# EAGLE design tractor_1v2 (EAGLE 9.0.1)
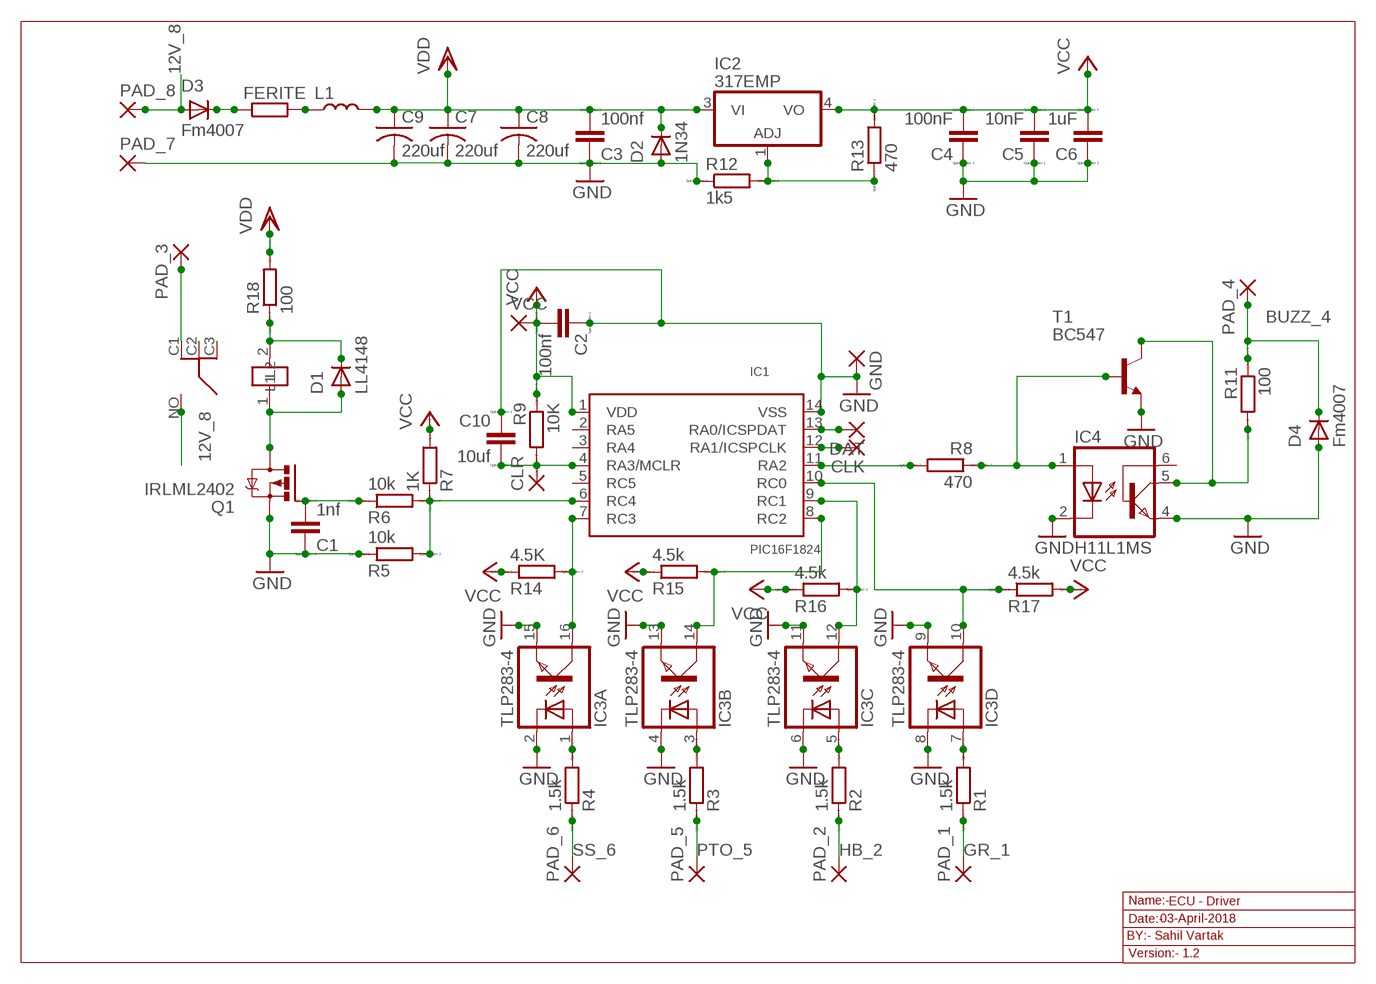
[diagram p0: schematic, sheet 1]

## Parts
C1  1nf  CC0603  [C0603]
C2  100nf  CC0603  [C0603]
C3  100nf  CC0603  [C0603]
C4  100nF  CC0603  [C0603]
C5  10nF  CC0603  [C0603]
C6  1uF  CC0603  [C0603]
C7  220uf  C-US025-025X050  [C025-025X050]
C8  220uf  C-US025-025X050  [C025-025X050]
C9  220uf  C-US025-025X050  [C025-025X050]
C10  10uf  CC0603  [C0603]
CLK  1,6/0,8  [1,6/0,8]
CLR  1,6/0,8  [1,6/0,8]
D1  LL4148  GF1  [SMA-DO214AC]
D2  1N34  GF1  [SMA-DO214AC]
D3  Fm4007  GF1  [SMA-DO214AC]
D4  Fm4007  GF1  [SMA-DO214AC]
DAT  1,6/0,8  [1,6/0,8]
FERITE  R-EU_R0603  [R0603]
GND  1,6/0,8  [1,6/0,8]
IC1  PIC16F1824  [SO-14]
IC2  317EMP  [SOT223]
IC3  TLP283-4  [MINI-FLAT-16]
IC4  H11L1MS  [DIL6-SMD]
K2  RL703  [RL703]
L1  R-US_WSC2515  [WSC2515]
PAD_1  2,54/1,1  [2,54/1,1]
PAD_2  2,54/1,1  [2,54/1,1]
PAD_3  2,54/1,1  [2,54/1,1]
PAD_4  2,54/1,1  [2,54/1,1]
PAD_5  2,54/1,1  [2,54/1,1]
PAD_6  2,54/1,1  [2,54/1,1]
PAD_7  2,54/1,1  [2,54/1,1]
PAD_8  2,54/1,1  [2,54/1,1]
Q1  IRLML2402  IRLML5203  [MICRO3]
R1  1.5k  RR0603  [R0603]
R2  1.5k  RR0603  [R0603]
R3  1.5k  RR0603  [R0603]
R4  1.5k  RR0603  [R0603]
R5  10k  RR0603  [R0603]
R6  10k  RR0603  [R0603]
R7  1K  RR0603  [R0603]
R8  470  RR0603  [R0603]
R9  10K  RR0603  [R0603]
R11  100  RR0603  [R0603]
R12  1k5  RR0603  [R0603]
R13  470  RR0603  [R0603]
R14  4.5K  RR0603  [R0603]
R15  4.5k  RR0603  [R0603]
R16  4.5k  RR0603  [R0603]
R17  4.5k  RR0603  [R0603]
R18  100  RR0603  [R0603]
T1  BC547  [TO92]
VCC  1,6/0,8  [1,6/0,8]

## Nets
12V_8: D3.A K2.NO PAD_8.1(P)
BUZZ_4: D4.K(C) PAD_4.1(P) R11.1
GND: C1.1 C2.1 C3.1 C4.1 C5.1 C6.1 C7.2 C8.2 C9.2 C10.1 D2.A D4.A GND.1(P) IC1.14(VSS) IC3.2(A:C) IC3.4(B:C) IC3.6(C:C) IC3.8(D:C) IC3.9(D:EMIT) IC3.11(C:EMIT) IC3.13(B:EMIT) IC3.15(A:EMIT) IC4.2(C) IC4.4(EMI) PAD_7.1(P) Q1.2(S) R5.1 R12.1 T1.1(E)
GR_1: PAD_1.1(P) R1.1
HB_2: PAD_2.1(P) R2.1
N$3: IC1.10(RC0) IC3.10(D:COL) R17.1
N$5: D1.A K2.1(L2) Q1.3(D)
N$7: D3.K(C) FERITE.1
N$8: DAT.1(P) IC1.13(RA0/ICSPDAT)
N$9: CLK.1(P) IC1.12(RA1/ICSPCLK)
N$13: D1.K(C) K2.2(L1) R18.1
N$14: IC2.1(ADJ) R12.2 R13.1
N$15: FERITE.2 L1.1
N$72: C1.2 Q1.1(G) R6.1
N$74: IC1.6(RC4) R5.2 R6.2 R7.1
N$76: IC3.1(A:A) R4.2
N$78: IC3.3(B:A) R3.2
N$80: IC3.5(C:A) R2.2
N$82: IC3.7(D:A) R1.2
N$84: IC1.9(RC1) IC3.12(C:COL) R16.2
N$85: IC1.8(RC2) IC3.14(B:COL) R15.2
N$86: IC1.7(RC3) IC3.16(A:COL) R14.2
N$87: C10.2 CLR.1(P) IC1.4(RA3/MCLR) R9.2
N$88: IC1.11(RA2) R8.2
N$89: IC4.1(A) R8.1 T1.2(B)
N$90: IC4.5(COL) R11.2 T1.3(C)
PTO_5: PAD_5.1(P) R3.1
R_3: K2.C1 PAD_3.1(P)
SS_6: PAD_6.1(P) R4.1
VCC: C2.2 C4.2 C5.2 C6.2 IC1.1(VDD) IC2.4(VO) R7.2 R9.1 R13.2 R14.1 R15.1 R16.1 R17.2 VCC.1(P)
VDD: C3.2 C7.1 C8.1 C9.1 D2.K(C) IC2.3(VI) L1.2 R18.2
Unconnected: IC1.2(RA5) IC1.3(RA4) IC1.5(RC5) IC4.6(BAS) K2.C2 K2.C3

## Notes on the sheet
- Name:- | ECU - Driver
- Date:- | 03-April-2018
- BY:- Sahil Vartak
- Version:- 1.2

## Library data of the parts
C1-C6 C10 = eagle-ltspice:C: CAPACITOR, European symbol; SPICEMODEL: NONE; SPICEPREFIX: C
C7-C9 = rcl:C-US: CAPACITOR, American symbol
CLK CLR DAT GND VCC = wirepad:1,6/0,8: THROUGH-HOLE PAD
D1-D4 = diode:GF1: DIODE
FERITE = resistor:R-EU_: RESISTOR, European symbol
IC1 = microchip:PIC16F1824
IC2 = lm317:*317: Positive VOLTAGE REGULATOR
IC3 = optocoupler:TLP283-4: TOSHIBA PHOTOCOUPLER GaAs IRED & PHOTO-TRANSISTOR Source: http://www.semicon.toshiba.co.jp/td/en/Opto/Photocoupler/en_20050928_TLP283_datasheet.pdf; OC_FARNELL: unknown; OC_NEWARK: unknown
IC4 = optocoupler:H11L*M: 6-Pin DIP Optocoupler Source: http://www.fairchildsemi.com/ds/H1/H11L2-M.pdf; OC_FARNELL: unknown; OC_NEWARK: unknown
K2 = relay:RL703
L1 = resistor:R-US_: RESISTOR, American symbol
PAD_1-PAD_8 = wirepad:2,54/1,1: THROUGH-HOLE PAD
Q1 = transistor-power:IRLML5203: HEXFET P-Channel Power MOSFET
R1-R9 R11-R18 = eagle-ltspice:R: RESISTOR, European symbol; SPICEMODEL: NONE; SPICEPREFIX: R
T1 = transistor-neu-to92:BC547: NPN TRANSISTOR

## Board
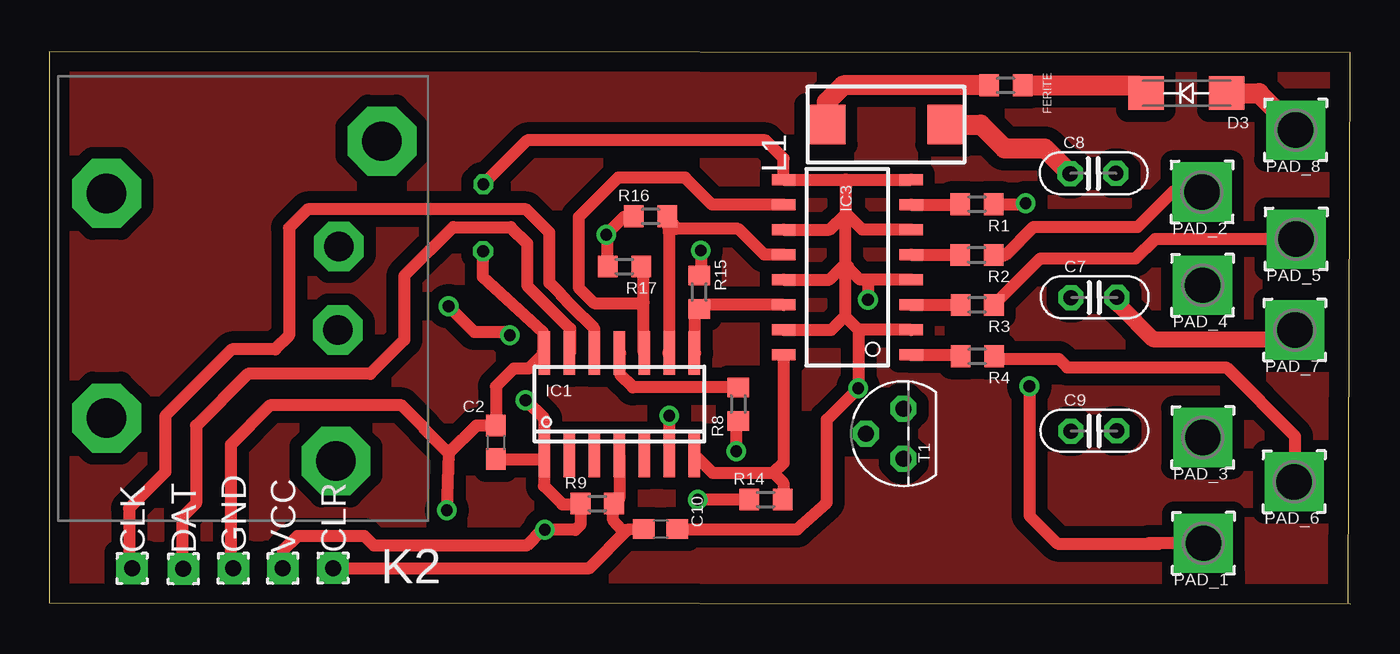
[diagram p1: board, top side]
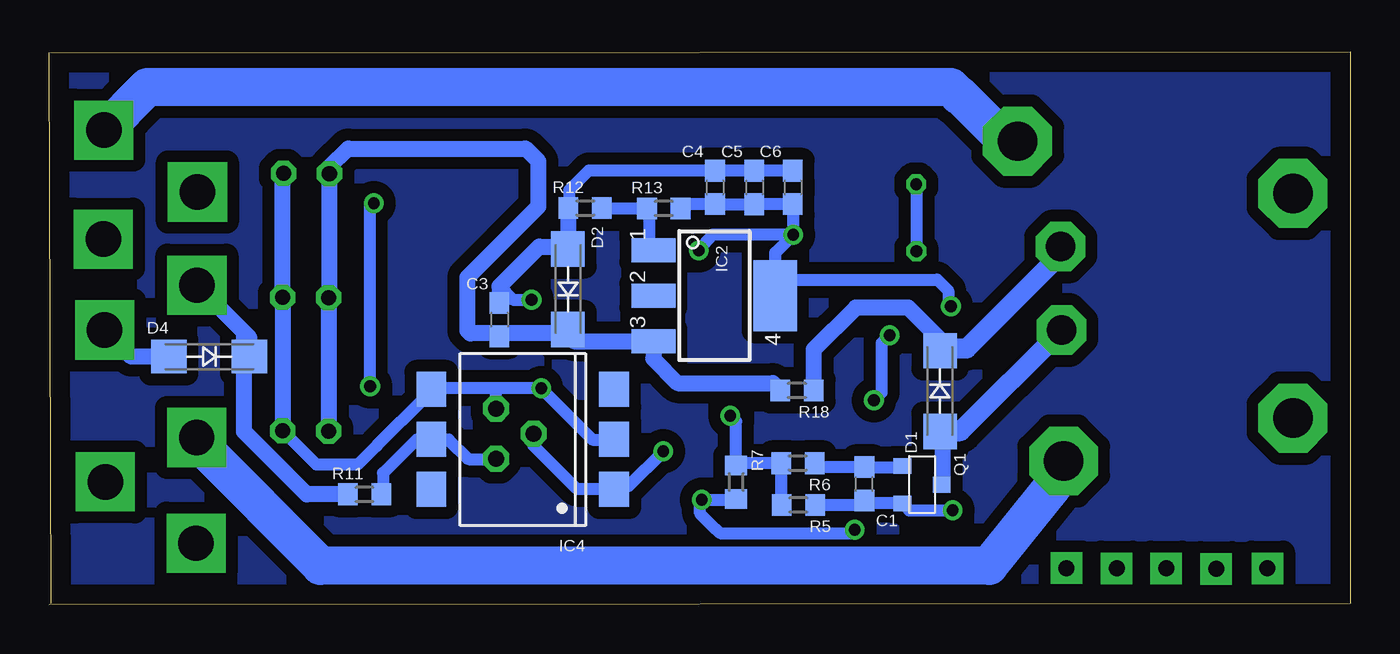
[diagram p2: board, bottom side, seen from below]

Size 66.1 x 28.07 mm. Coordinates in mm from the lower left corner, seen from the top.
Outline: 66,0.06 66.1,28.01 0,28.07 0,0.06 66.1,0
Copper layers (1*16): Top 0.035mm / dielectric 1.5mm / Bottom 0.035mm
Design rules "default": minimum track width 10mil, minimum drill 24mil, track to track 8mil, track to pad 8mil, pad to pad 8mil, via to via 8mil, smd to smd 8mil, copper to edge 40mil, drill to drill 8mil, minimum pad ring 10mil, minimum via ring 8mil, stop-mask expansion 4mil, vias tented up to drill 0mil, thermal gap 10mil

### Footprints (pad centres in the part's own frame; a part is rotated, then mirrored left to right if it is on the bottom)
C0603 = smd 1.1 x 1: 1 -0.85,0; 2 0.85,0
C025-025X050 = drill 0.762 pad 1.27 octagon: 1 -1.176,-0.006; 2 1.159,0.007
1,6/0,8 = drill 0.813 pad 1.6 square: 1 0,0
SMA-DO214AC = smd 1.8 x 1.7: A -2.05,0; K 2.05,0
R0603 = smd 1 x 1.1: 1 -0.85,0; 2 0.85,0
SO-14 = smd 0.6 x 2.2: 1 -3.81,-2.6; 2 -2.54,-2.6; 3 -1.27,-2.6; 4 0,-2.6; 5 1.27,-2.6; 6 2.54,-2.6; 7 3.81,-2.6; 8 3.81,2.6; 9 2.54,2.6; 10 1.27,2.6; 11 0,2.6; 12 -1.27,2.6; 13 -2.54,2.6; 14 -3.81,2.6
SOT223 = smd 1.219 x 2.235: 1 -2.311,-3.099; 2 0,-3.099; 3 2.311,-3.099 | smd 3.6 x 2.2: 4 0,3.099
MINI-FLAT-16 = smd 1.2 x 0.56: 1 -3.24,4.445; 2 -3.24,3.175; 3 -3.24,1.905; 4 -3.24,0.635; 5 -3.24,-0.635; 6 -3.24,-1.905; 7 -3.24,-3.175; 8 -3.24,-4.445; 9 3.24,-4.445; 10 3.24,-3.175; 11 3.24,-1.905; 12 3.24,-0.635; 13 3.24,0.635; 14 3.24,1.905; 15 3.24,3.175; 16 3.24,4.445
DIL6-SMD = smd 1.78 x 1.52: 1 -2.54,-4.645; 2 0,-4.645; 3 2.54,-4.645; 4 2.54,4.645; 5 0,4.645; 6 -2.54,4.645
RL703 = drill 1.5 pad 2.5 octagon: 1 1.73,-5.643; 2 -2.51,-5.693 | drill 2 pad 3.5 octagon: C1 8.38,-5.543; C2 6.2,6.107; C3 -5.21,6.107; NO -7.86,-7.883
WSC2515 = smd 2 x 2: 1 -3.075,0; 2 3.075,0
2,54/1,1 = drill 1.8 pad 3 square: 1 0,0
MICRO3 = smd 0.8 x 0.9: 1 -0.95,-1; 2 0.95,-1; 3 0,1
TO92 = drill 0.813 octagon: 1 1.27,0; 2 0,1.905; 3 -1.27,0

### Placement (x,y rotation side)
C1  24.69,6.12 90 bottom
C2  22.69,8.23 270 top
C3  43.23,14.46 270 bottom
C4  32.28,21.18 270 bottom
C5  30.28,21.17 270 bottom
C6  28.32,21.18 270 bottom
C7  53.09,15.58 0 top
C8  53.04,21.88 0 top
C9  53.08,8.8 0 top
C10  31.06,3.82 180 top
CLK  4.21,1.82 0 top
CLR  14.42,1.84 0 top
D1  20.84,10.83 90 bottom
D2  39.75,16.01 270 bottom
D3  57.77,25.96 180 top
D4  57.97,12.58 0 bottom
DAT  6.81,1.8 0 top
FERITE  48.6,26.36 180 top
GND  9.35,1.83 0 top
IC1  28.96,10.17 0 top
IC2  32.31,15.68 270 bottom
IC3  40.55,17.12 180 top
IC4  42.04,8.38 90 bottom
K2  9.02,15.66 270 bottom
L1  42.53,24.36 0 top
PAD_1  58.64,3.11 180 top
PAD_2  58.57,20.94 180 top
PAD_3  58.61,8.48 180 top
PAD_4  58.59,16.21 180 top
PAD_5  63.35,18.56 180 top
PAD_6  63.25,6.23 180 top
PAD_7  63.28,13.94 180 top
PAD_8  63.32,24.09 180 top
Q1  21.76,6.08 270 bottom
R1  47.13,20.32 180 top
R2  47.13,17.74 180 top
R3  47.15,15.21 180 top
R4  47.15,12.6 180 top
R5  28.04,5.05 180 bottom
R6  28.07,7.17 180 bottom
R7  31.21,6.21 270 bottom
R8  35.01,10.17 90 top
R9  27.85,5.12 0 top
R11  50.08,5.59 0 bottom
R12  38.88,20.13 0 bottom
R13  34.88,20.11 0 bottom
R14  36.41,5.32 0 top
R15  33.02,15.86 270 top
R16  30.55,19.71 0 top
R17  29.22,17.16 180 top
R18  28.11,10.86 180 bottom
T1  43.4,8.67 90 top
VCC  11.86,1.83 0 top

### Tracks (layer width: path | path; a pad name or v marks a point on that pad's centre or on a via)
12V_8
  Top 1.016: D3.A 61.45,25.96 PAD_8.1
  Bottom 1.93: PAD_8.1 63.28,24.09 61.11,26.26 20.3,26.26 19.89,25.85 19.83,25.85 17.3,23.33 K2.NO
BUZZ_4
  Bottom 0.813: R11.1 53.02,5.59 56.2,8.77 56.2,13.81 | 56.2,13.81 PAD_4.1 | D4.K 55.92,13.53 56.2,13.81
GND  (via drill 0.6)
  Top 0.406: 40.48,21.57 40.48,21.22
  Top 0.61: IC3.8 40.44,21.57 40.48,21.53 40.48,21.22 40.48,19.86 | IC3.11 39.64,19.03 40.44,19.83 | IC3.6 41.31,19.03 40.48,19.86 | IC3.4 41.6,16.49 | 41.6,16.49 41.2,16.49 40.59,17.1 40.59,17.15 40.48,17.26 | 40.48,17.26 40.44,17.3 | 40.44,17.3 40.44,19.83 | 40.44,19.83 40.48,19.86 | IC3.13 39.63,16.49 40.44,17.3 | IC3.2 41.1,13.95 | 41.1,13.95 40.42,14.63 | 40.48,17.26 40.42,17.2 40.42,14.63 | IC3.15 39.73,13.95 40.42,14.63 | 20.3,7.67 21.7,9.08 C2.1 22.7,9.09 22.7,11.07 23.6,11.97 24.36,11.97 IC1.14 25.09,12.84 25.09,13.83 22.04,16.62 v22.04,17.93 v22.05,17.94 | 20.3,7.67 v20.2,4.77 | 41.6,16.49 v41.6,15.47 | 41.1,13.95 v41.1,10.97 | v41.1,10.97 | C10.1 38,3.81 39.51,5.16 39.51,9.38 v41.1,10.97 | 20.3,7.67 19.07,8.9 19.07,8.94 17.91,10.1 11.21,10.1 9.22,8.11 9.22,1.96 GND.1 | v22.05,21.33 24.28,23.56 36.39,23.56 37.3,22.65 IC3.9 40.48,21.57
  Top 0.813: C7.2 54.36,15.18 56.07,13.47 62.82,13.47 PAD_7.1
  Bottom 0.61: R5.1 24.91,5.05 C1.1 24.55,5.13 Q1.2 22.4,4.77 v20.2,4.77 | C5.1 | C6.1 C5.1 | 43.23,16.15 42.55,15.47 v41.6,15.47 | 43.3,10.97 v41.1,10.97 38.5,8.37 IC4.2 | 43.3,10.97 46.82,10.97 | 46.82,10.97 46.98,10.97 46.98,10.53 49.46,8.05 49.47,8.05 50.43,7.09 52.52,7.09 C9.2 | T1.1 43.4,10.87 43.3,10.97 | IC4.4 46.77,10.92 46.82,10.97 | R12.1 39.68,20.18 39.68,21.04 38.7,22.03 C4.1 C5.1 | v22.05,21.33 22.05,18.2 v22.05,17.94 | 54.24,15.58 C7.2
  Bottom 0.813: 39.93,17.77 D2.A | R12.1 39.76,17.95 D2.A | D2.A 39.86,18.17 41.2,18.17 43.23,16.15 C3.1 43.27,15.26 | D4.A 61.93,12.58 PAD_7.1 | C7.2 54.25,21.84 C8.2 | 54.24,15.58 C9.2
GR_1  (via drill 0.6)
  Top 0.61: PAD_1.1 56.44,3.11 | 56.44,3.11 55.87,3.11 | R1.1 49.55,20.32 v49.6,20.37 | v49.8,11.07 49.8,4.5 51.22,3.08 56.42,3.08 56.44,3.11
  Bottom 0.61: v49.8,11.07 49.8,20.17 v49.6,20.37
HB_2
  Top 0.61: 48.01,17.77 R2.1 48.57,17.74 50,19.17 55.3,19.17 57.1,20.97 58.53,20.97 PAD_2.1
N$1
  pour Bottom (isolate 0.61): 66,0.06 0,0.06 0,27.97 66,27.97
N$3
  Top 0.61: IC1.10 30.2,12.8 30.2,15.32 | 30.2,15.32 30.2,17.03 R17.1 | IC3.10 33.68,20.3 32.3,21.67 28.9,21.67 26.9,19.67 26.9,16.09 27.69,15.3 30.18,15.3 30.2,15.32
N$5
  Bottom 0.61: 20.7,6.14 Q1.3 | 20.7,8.64 D1.A
  Bottom 0.813: 20.7,6.14 20.7,8.64
  Bottom 1.016: D1.A 19.8,8.79 K2.1
N$6
  pour Top (isolate 0.61): 65.9,0.06 0,0.06 0,27.97 65.9,27.97
N$7
  Top 1.016: FERITE.1 55.32,26.36 D3.K
N$8
  Top 0.61: 19.39,18.01 19.39,18.02 | 19.39,18.02 20.53,19.16 23.45,19.16 24.28,18.33 24.28,16.18 26.46,14 26.46,12.81 IC1.13 | 19.39,18.02 19.38,18.02 18.04,16.68 18.04,13.43 16.31,11.7 10.09,11.7 7.46,9.07 7.46,5.13 6.75,4.42 6.75,1.86 DAT.1
N$9
  Top 0.61: IC1.12 27.69,13.99 26.51,15.17 26.51,15.2 26.02,15.69 26.02,15.71 25.41,16.32 25.41,18.88 24.23,20.06 13.12,20.06 12.18,19.12 12.18,13.65 11.48,12.95 9.28,12.95 5.9,9.57 5.9,6.71 4.06,4.87 4.06,1.97 CLK.1
N$13
  Bottom 0.813: D1.K 20.85,13.46 22.46,15.07 25.12,15.07 27.26,12.93 R18.1
  Bottom 1.016: K2.2 14.71,17.77 19.5,12.98 20.74,12.98 D1.K
N$14
  Bottom 0.61: IC2.1 35.6,18.18 35.6,19.98 R13.1 R12.2
N$15
  Top 1.016: FERITE.2 40.34,26.36 39.5,25.52 39.5,24.41 L1.1
N$72
  Bottom 0.61: R6.1 27.12,6.97 C1.2 22.82,6.97 Q1.1
N$74  (via drill 0.6)
  Top 0.61: IC1.6 v31.5,9.57
  Bottom 0.61: R5.2 28.89,7.03 R6.2 31.1,7.17 R7.1 | 31.2,7.05 R7.1 | R7.1 31.21,9.28 v31.5,9.57
N$76
  Top 0.61: IC3.1 46.22,12.68 R4.2
N$78
  Top 0.61: IC3.3 46.28,15.22 R3.2
N$80
  Top 0.61: IC3.5 46.26,17.76 R2.2
N$82
  Top 0.61: IC3.7 46.25,20.3 R1.2
N$84
  Top 0.61: 31.44,12.77 IC1.9 31.5,18.71 R16.2 31.87,19.07 35.01,19.07 36.33,17.76 IC3.12
N$85
  Top 0.61: IC1.8 32.82,12.77 32.82,14.81 R15.2 | 33.01,15.22 R15.2 | IC3.14 33.23,15.22 R15.2
N$86
  Top 0.61: IC3.16 37.3,7.18 36.8,6.67 | IC1.7 32.77,7.6 | 32.77,8.35 32.77,7.6 | 32.77,7.6 33.7,6.67 36.8,6.67 | 36.8,6.67 37.3,6.17 37.3,5.36 R14.2
N$87
  Top 0.61: IC1.4 28.96,5.39 R9.2 28.65,5.08 28.65,4.28 29.1,3.76 29.39,3.78 | C10.2 29.39,3.78 | 29.39,3.78 27.45,1.84 CLR.1
N$88
  Top 0.61: R8.2 29.66,11.02 29,11.67 29,12.73 IC1.11
N$89  (via drill 0.6)
  Top 0.61: R8.1 34.9,9.31 v34.9,7.77
  Bottom 0.61: 35,7.67 v34.9,7.77 36.66,6.02 37.55,6.02 | 37.75,6.02 37.55,6.02 | 37.55,5.87 39.3,5.87 41.49,8.07 T1.2 | IC4.1 37.39,5.87 37.55,5.87 | 37.55,5.87 37.55,6.02
N$90
  Bottom 0.61: 49.4,5.77 R11.2 49.14,5.68 49.14,6.66 47.43,8.37 IC4.5 | T1.3 43.43,7.37 44.8,7.37 45.8,8.37 IC4.5 | IC4.5
PTO_5
  Top 0.61: R3.1 50.36,17.57 50.37,17.56 55.19,17.56 56.18,18.56 PAD_5.1
R_3
  Bottom 1.93: PAD_3.1 58.4,8.27 58.4,8.07 52.31,1.95 18.35,1.95 15.09,6.01 15.09,6.67 K2.C1 15.1,6.8
SS_6
  Top 0.61: R4.1 48.13,12.47 51.28,12.47 51.72,12.03 59.79,12.03 63.29,8.53 63.29,6.27 PAD_6.1
VCC  (via drill 0.6)
  Top 0.61: C2.2 24.96,7.38 25.14,7.55 | 26.97,5.09 R9.1 | 25.14,7.55 IC1.1 25.15,9.42 v24.2,10.37 | R9.1 | v33.1,17.97 33.1,16.79 R15.1 | 28.36,18.71 v28.3,18.77 | v32.95,5.32 R14.1 | R17.2 28.37,18.7 v28.3,18.77 | R16.1 29.24,19.71 v28.3,18.77 | 25.14,7.55 25.14,6.02 26.07,5.08 26.96,5.08 R9.1 | R9.1 27,5.11 26.99,5.11 26.99,4.04 26.73,3.79 v25.18,3.79 | v25.18,3.79 v25.18,3.78 | 23.36,13.71 v23.4,13.67 23.24,13.83 21.6,13.83 v20.29,15.14 | v25.18,3.79 25.04,3.79 24.24,2.98 16.5,2.98 16.02,3.46 12.61,3.46 11.87,2.72 VCC.1
  Bottom 0.61: v28.3,18.77 28.3,20.3 C6.2 C5.2 C4.2 33.53,20.32 R13.2 | R7.2 31.25,5.32 v32.95,5.32 33.03,5.24 33.03,4.61 32.22,3.8 32.2,3.8 32.02,3.62 25.34,3.62 v25.18,3.78 | v28.3,18.77 32.4,18.77 v33.1,17.97 | 29.21,16.22 IC2.4 28.86,16.02 | 29.21,16.22 29.21,17.87 v28.3,18.77 | v24.2,10.37 23.8,10.77 23.8,13.27 v23.4,13.67 | 29.06,16.07 29.21,16.22 | 28.79,16.09 28.86,16.02 | 28.86,16.02 28.86,16.16 28.53,16.49 20.98,16.49 20.42,15.93 20.42,15.27 v20.29,15.14
VDD
  Top 1.016: L1.2 47.33,24.36 48.53,23.16 50.58,23.16 C8.1
  Bottom 0.61: 39.45,13.37 D2.K
  Bottom 0.813: 43.29,13.67 C3.2 | D2.K 39.95,13.76 43.08,13.76 | 39.45,13.37 IC2.3 35.4,12.48 34.17,11.24 29.34,11.24 R18.2 | 43.3,13.53 C3.2 | 43.27,13.56 C3.2 | 43.08,13.76 44.71,13.76 44.85,13.9 44.85,16.6 41.24,20.21 41.24,22.49 41.91,23.16 41.93,23.14 50.91,23.14 51.86,22.19 C8.1 51.86,15.63 C7.1 51.91,8.81 C9.1 | 43.08,13.76 C3.2